# EAGLE design smh (EAGLE 8.4.1)
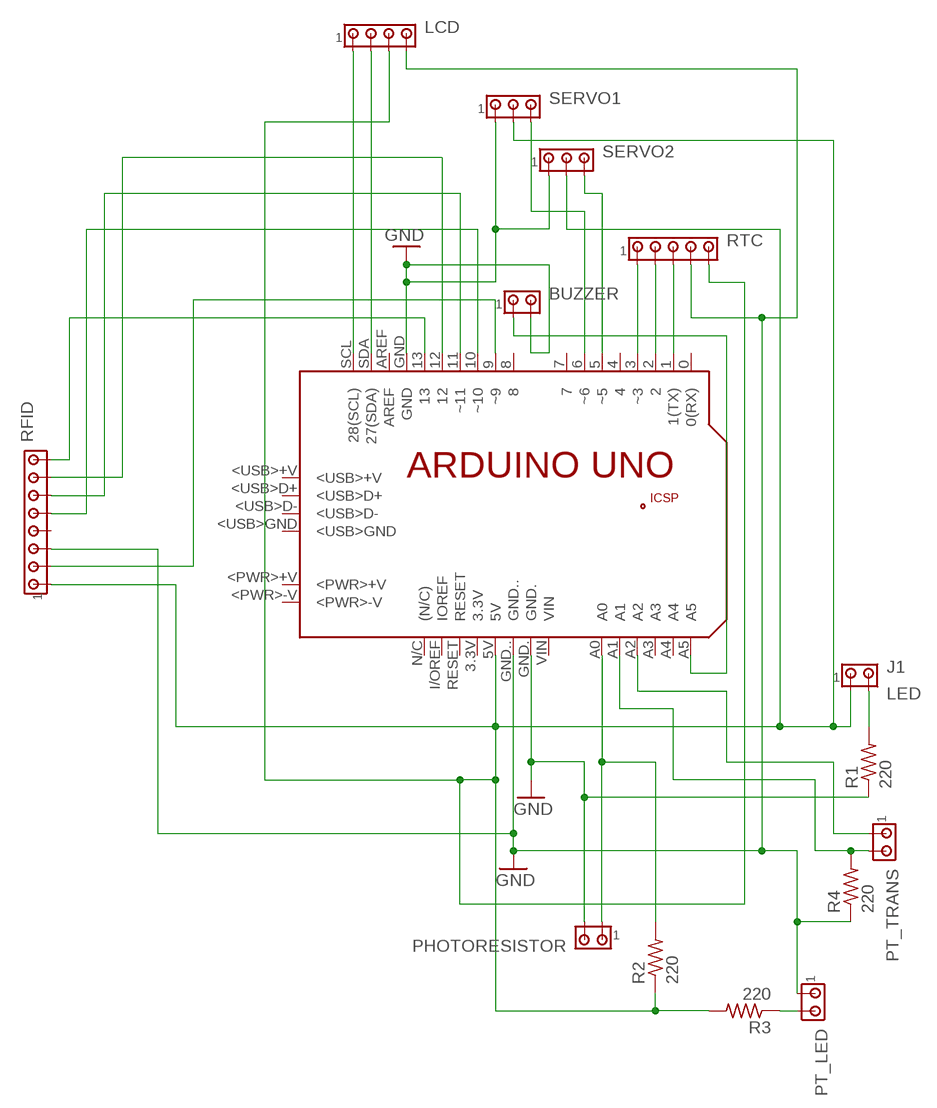
[diagram p0: schematic, sheet 1]

## Parts
BUZZER  MTA02-100  [10X02MTA]
J1  LED  MTA02-100  [10X02MTA]
LCD  MTA04-100  [10X04MTA]
PCB1  ARDUINO_UNO  [ARDUINO_UNO]
PHOTORESISTOR  MTA02-100  [10X02MTA]
PT_LED  MTA02-100  [10X02MTA]
PT_TRANS  MTA02-100  [10X02MTA]
R1  220  R-US_0309/10  [0309/10]
R2  220  R-US_0309/10  [0309/10]
R3  220  R-US_0309/10  [0309/10]
R4  220  R-US_0309/10  [0309/10]
RFID  MTA08-100  [10X08MTA]
RTC  MTA05-100  [10X05MTA]
SERVO1  MTA03-100  [10X03MTA]
SERVO2  MTA03-100  [10X03MTA]

## Nets
GND: BUZZER.2 LCD.4 PCB1.GND PCB1.GND. PCB1.GND.. PHOTORESISTOR.2 PT_LED.1 R1.1 R4.1 RFID.3 RTC.4 SERVO1.1 SERVO2.1
N$1: BUZZER.1 PCB1.A5
N$2: LCD.2 PCB1.SDA(27(SDA))
N$3: PCB1.1(1(TX)) RTC.3
N$4: PCB1.2 RTC.2
N$5: PCB1.6(~6) SERVO1.3
N$6: PCB1.3(~3) RTC.1
N$7: PCB1.5(~5) SERVO2.3
N$8: LCD.1 PCB1.SCL(28(SCL))
N$9: PT_LED.2 R3.1
N$10: PCB1.A0 PHOTORESISTOR.1 R2.2
N$11: J1.1 LCD.3 PCB1.5V R2.1 R3.2 RFID.1 RTC.5 SERVO1.2 SERVO2.2
N$12: PCB1.9(~9) RFID.2
N$13: J1.2 R1.2
N$14: PCB1.13 RFID.8
N$15: PCB1.10(~10) RFID.5
N$16: PCB1.11(~11) RFID.6
N$17: PCB1.12 RFID.7
N$18: PCB1.A1 PT_TRANS.2 R4.2
N$19: PCB1.A2 PT_TRANS.1
Unconnected: PCB1.0(0(RX)) PCB1.3.3V PCB1.4 PCB1.7 PCB1.8 PCB1.+5V PCB1.<PWR>+V PCB1.<PWR>-V PCB1.<USB>+V PCB1.<USB>D+ PCB1.<USB>D- PCB1.<USB>GND PCB1.A3 PCB1.A4 PCB1.AREF PCB1.GND_ PCB1.I/OREF(IOREF) PCB1.MISO PCB1.MOSI PCB1.N/C((N/C)) PCB1.RESET PCB1.RESET. PCB1.SCK PCB1.VIN RFID.4

## Library data of the parts
BUZZER J1 PHOTORESISTOR PT_LED PT_TRANS = con-amp:MTA02-100: AMP connector
LCD = con-amp:MTA04-100: AMP connector
PCB1 = Arduino_Shield:ARDUINO_UNO: Device for representing an Arduino Uno board with a footprint in an EAGLE design. Created by Dave Young for Element14. More EAGLE documentation at: http://www.element14.com/community/community/knode/cadsoft_eagle
R1-R4 = ECE2240+Project:R-US_: RESISTOR, American symbol
RFID = con-amp:MTA08-100: AMP connector
RTC = con-amp:MTA05-100: AMP connector
SERVO1 SERVO2 = con-amp:MTA03-100: AMP connector

## Net classes
0 default: width 0.61 mm

## Board
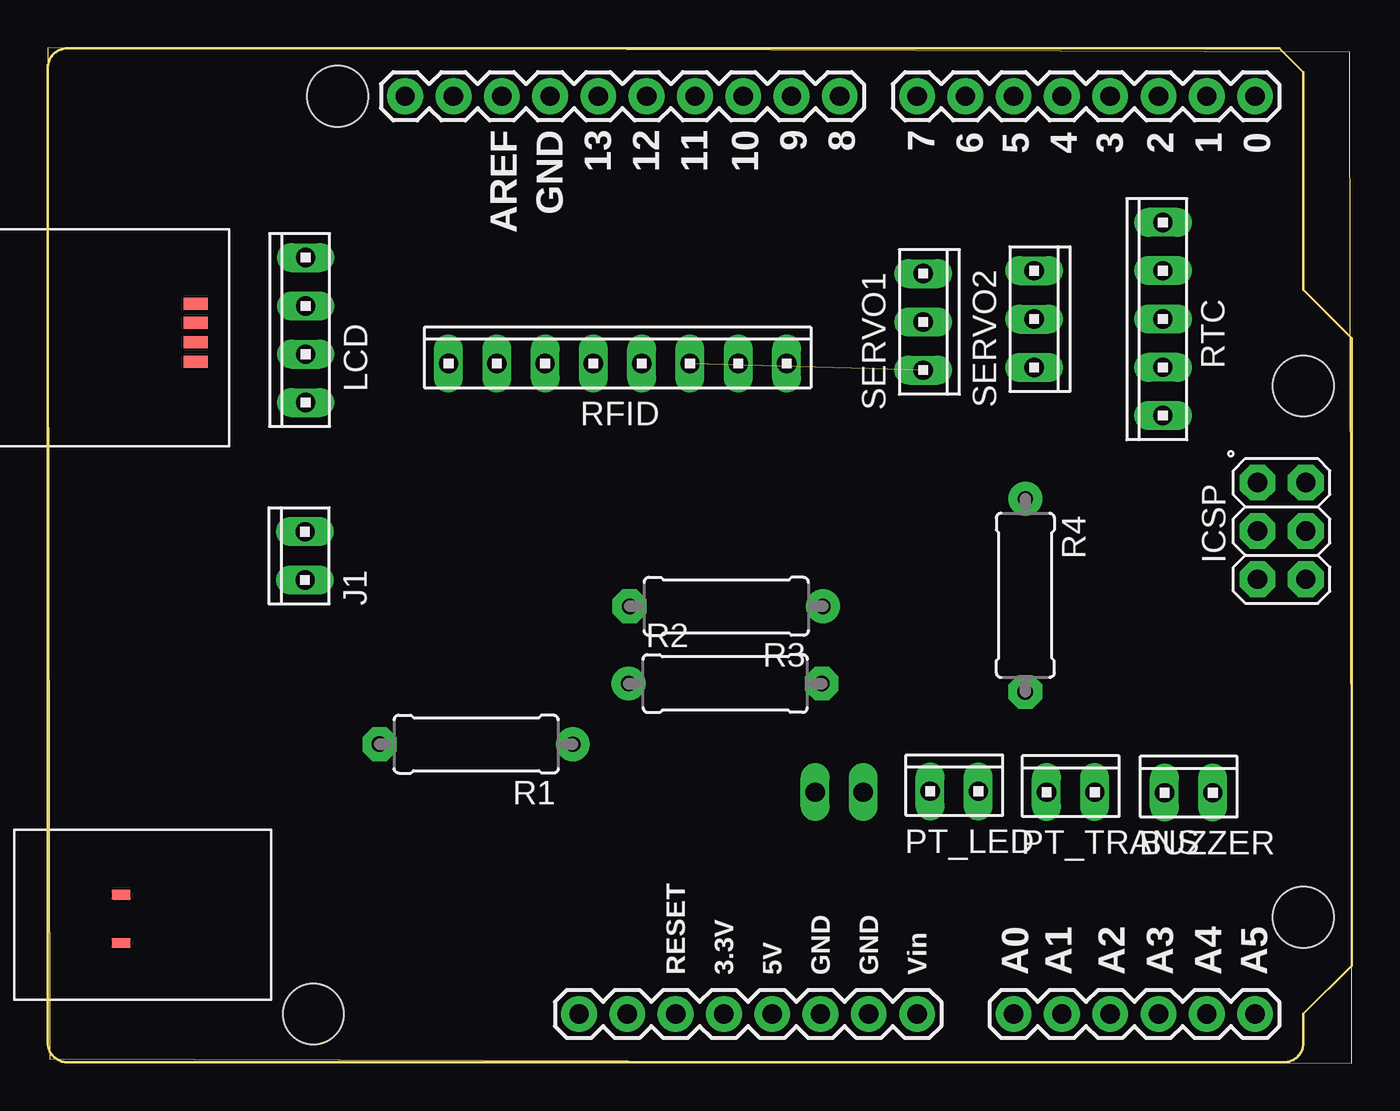
[diagram p1: board, top side]
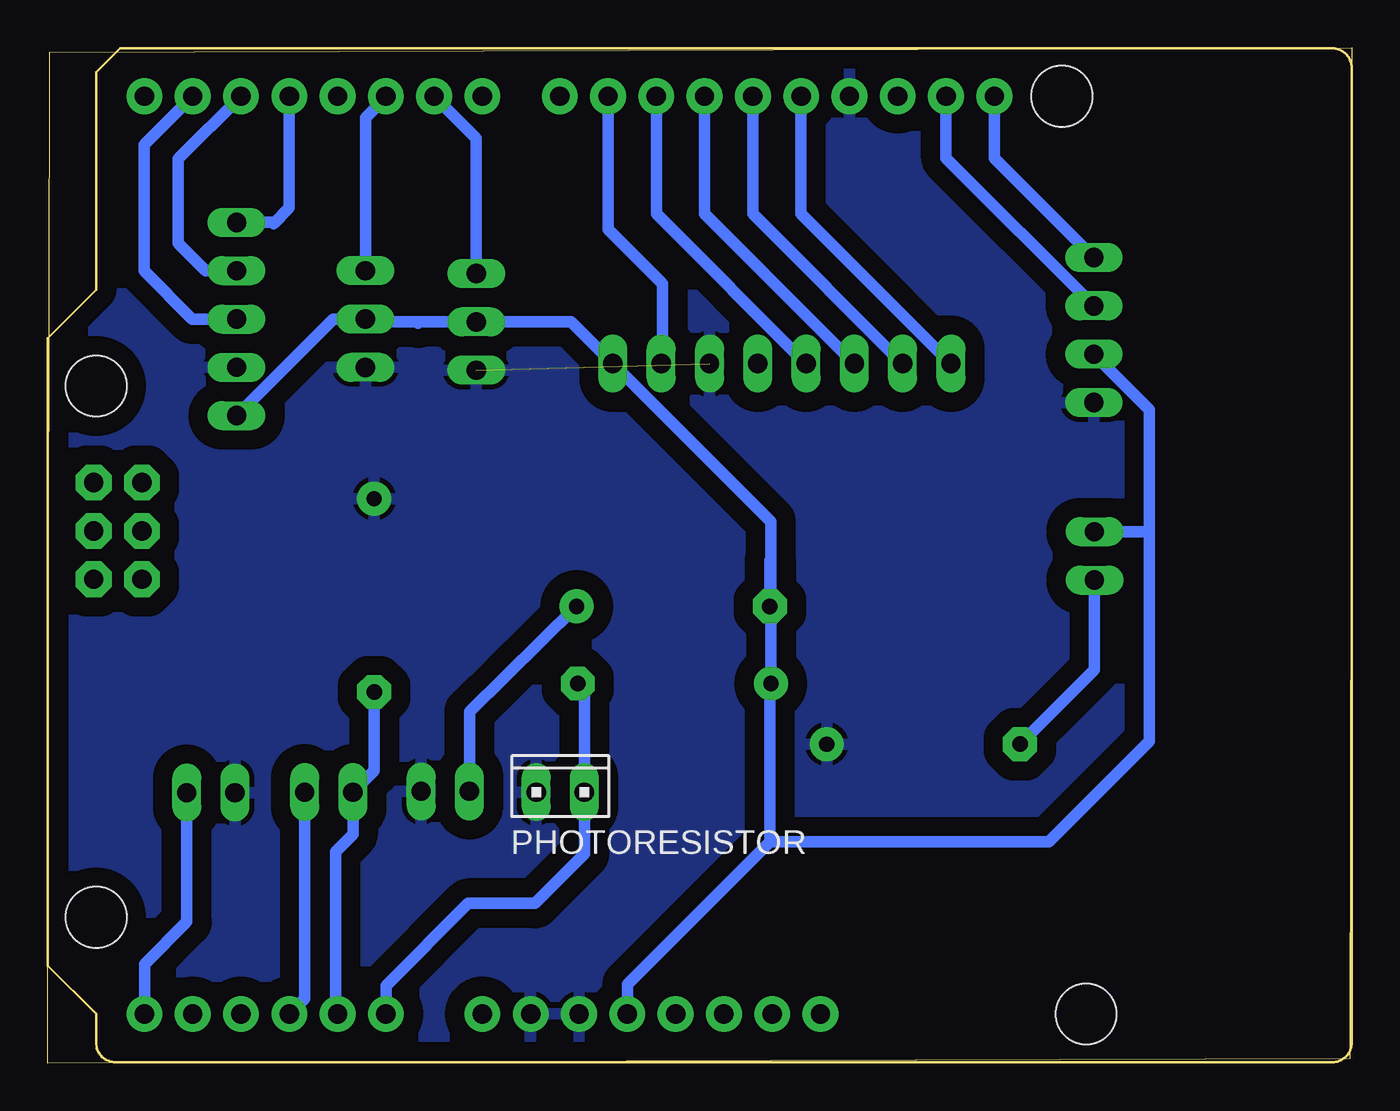
[diagram p2: board, bottom side, seen from below]

Size 68.61 x 53.41 mm. Coordinates in mm from the lower left corner, seen from the top.
Outline: 0.11,0.24 68.61,0 68.5,53.17 0,53.41 0.11,0.24
Copper layers (1*16): Top 0.035mm / dielectric 1.5mm / Bottom 0.035mm
Design rules "default *": minimum track width 24mil, minimum drill 0.35mm, track to track 6mil, track to pad 6mil, pad to pad 6mil, via to via 6mil, smd to smd 6mil, copper to edge 40mil, drill to drill 6mil, minimum pad ring 10mil, minimum via ring 8mil, stop-mask expansion 4mil, vias tented up to drill 0mil, thermal gap 10mil

### Footprints (pad centres in the part's own frame; a part is rotated, then mirrored left to right if it is on the bottom)
10X02MTA = drill 1.016 long: 1 1.27,0; 2 -1.27,0
10X04MTA = drill 1.016 long: 1 3.81,0; 2 1.27,0; 3 -1.27,0; 4 -3.81,0
ARDUINO_UNO = drill 1.016 pad 1.88: 0 63.5,50.8; 1 60.96,50.8; 2 58.42,50.8; 3 55.88,50.8; 3.3V 35.56,2.54; 4 53.34,50.8; 5 50.8,50.8; 5V 38.1,2.54; 6 48.26,50.8; 7 45.72,50.8; 8 41.656,50.8; 9 39.116,50.8; 10 36.576,50.8; 11 34.036,50.8; 12 31.496,50.8; 13 28.956,50.8; A0 50.8,2.54; A1 53.34,2.54; A2 55.88,2.54; A3 58.42,2.54; A4 60.96,2.54; A5 63.5,2.54; AREF 23.876,50.8; GND 26.416,50.8; GND. 43.18,2.54; GND.. 40.64,2.54; I/OREF 30.48,2.54; N/C 27.94,2.54; RESET 33.02,2.54; SCL 18.796,50.8; SDA 21.336,50.8; VIN 45.72,2.54 | drill 1.016 pad 1.88 octagon: +5V 66.167,30.48; GND_ 66.167,25.4; MISO 63.627,30.48; MOSI 66.167,27.94; RESET. 63.627,25.4; SCK 63.627,27.94 | smd 1.016 x 0.508: <PWR>+V 3.861,8.814; <PWR>-V 3.861,6.274 | smd 1.27 x 0.635: <USB>+V 7.772,39.878; <USB>D+ 7.772,38.887; <USB>D- 7.772,37.871; <USB>GND 7.772,36.83 | hole 3.2: 66.04,7.62; 66.04,35.56; 15.24,50.8; 13.97,2.54
0309/10 = drill 0.8 pad 1.778: 1 -5.08,0 | drill 0.813 pad 1.778 octagon: 2 5.08,0
10X08MTA = drill 1.016 long: 1 8.89,0; 2 6.35,0; 3 3.81,0; 4 1.27,0; 5 -1.27,0; 6 -3.81,0; 7 -6.35,0; 8 -8.89,0
10X05MTA = drill 1.016 long: 1 5.08,0; 2 2.54,0; 3 0,0; 4 -2.54,0; 5 -5.08,0
10X03MTA = drill 1.016 long: 1 2.54,0; 2 0,0; 3 -2.54,0

### Placement (x,y rotation side)
BUZZER  60.02,14.23 0 top
J1  13.55,26.68 90 top
LCD  13.58,38.56 90 top
PCB1  0.02,0.06 0 top
PHOTORESISTOR  41.64,14.26 0 bottom
PT_LED  47.69,14.31 0 top
PT_TRANS  53.82,14.26 0 top
R1  22.55,16.78 180 top
R2  35.65,19.97 0 top
R3  35.7,24.03 180 top
R4  51.43,24.61 270 top
RFID  29.98,36.8 0 top
RTC  58.67,39.14 90 top
SERVO1  46.07,38.99 270 top
SERVO2  51.89,39.14 270 top

### Tracks (layer width: path | path; a pad name or v marks a point on that pad's centre or on a via)
GND  (1 unrouted)
  pour Bottom (isolate 1.016): -0.12,-0.13 -0.12,53.33 68.67,53.43 68.67,-0.03
N$1
  Bottom 0.61: PCB1.A5 63.51,5.22 61.29,7.44 BUZZER.1
N$2
  Bottom 0.61: LCD.2 21.35,47.61 PCB1.SDA
N$3
  Bottom 0.61: RTC.3 61,39.14 63.53,41.67 63.53,48.31 PCB1.1
N$4
  Bottom 0.61: PCB1.2 61.74,47.56 61.74,43.13 60.29,41.68 RTC.2
N$5
  Bottom 0.61: SERVO1.3 46.07,48.65 PCB1.6
N$6
  Bottom 0.61: PCB1.3 55.9,44.99 56.73,44.16 56.79,44.22 RTC.1
N$7
  Bottom 0.61: 50.52,50.56 50.78,50.82 | 50.78,50.82 PCB1.5 | SERVO2.3 51.89,49.72 50.78,50.82
N$8
  Bottom 0.61: LCD.1 18.81,47.61 PCB1.SCL
N$9
  Bottom 0.61: PT_LED.2 46.42,18.49 R3.1
N$10
  Bottom 0.61: PCB1.A0 50.82,4.08 46.49,8.41 42.98,8.41 40.37,11.02 PHOTORESISTOR.1 40.37,19.62 R2.2
N$11
  Bottom 0.61: 49.05,38.99 SERVO1.2 41.07,38.99 RFID.1 30.57,28.49 30.57,26.52 | 49.05,38.99 51.74,38.99 SERVO2.2 53.59,39.14 RTC.5 | RTC.5 58.63,34.1 | 49.12,38.92 49.05,38.99 | PCB1.5V 38.12,4.16 30.62,11.66 | LCD.3 10.66,34.37 10.66,28.01 | 10.66,28.01 10.66,16.95 15.95,11.66 30.62,11.66 | J1.1 10.72,27.95 10.66,28.01 | 30.62,11.66 30.62,19.92 R2.1 30.57,26.52 | R3.2 30.62,26.46 30.57,26.52 | RTC.5 58.49,34.06
N$12
  Bottom 0.61: 39.31,50.68 PCB1.9 39.13,43.86 36.27,41 36.27,36.86 RFID.2
N$13
  Bottom 0.61: R1.2 13.55,20.7 J1.2
N$14
  Bottom 0.61: RFID.8 28.97,44.68 PCB1.13
N$15
  Bottom 0.61: PCB1.10 36.59,44.68 RFID.5
N$16
  Bottom 0.61: PCB1.11 34.05,44.68 RFID.6
N$17
  Bottom 0.61: PCB1.12 31.51,44.68 RFID.7
N$18
  Bottom 0.61: R4.2 51.43,15.38 PT_TRANS.2 52.55,12.06 53.47,11.14 53.47,2.71 PCB1.A1
N$19
  Bottom 0.61: PT_TRANS.1 55.09,3.41 PCB1.A2